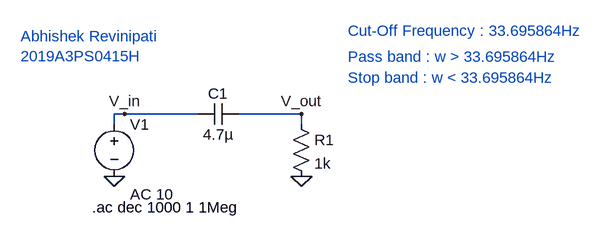
[diagram p0: schematic 2019A3PS0415H_high_pass.asc]
2019A3PS0415H_high_pass.asc, the LTspice schematic file:
Version 4
SHEET 1 880 680
WIRE 64 96 48 96
WIRE 176 96 64 96
WIRE 336 96 240 96
WIRE 48 112 48 96
WIRE 336 112 336 96
FLAG 48 192 0
FLAG 336 192 0
FLAG 336 96 V_out
FLAG 64 96 V_in
SYMBOL voltage 48 96 R0
WINDOW 123 24 124 Left 2
WINDOW 39 0 0 Left 0
SYMATTR InstName V1
SYMATTR Value ""
SYMATTR Value2 AC 10
SYMBOL cap 240 80 R90
WINDOW 0 0 32 VBottom 2
WINDOW 3 32 32 VTop 2
SYMATTR InstName C1
SYMATTR Value 4.7µ
SYMBOL res 320 96 R0
SYMATTR InstName R1
SYMATTR Value 1k
TEXT 14 240 Left 2 !.ac dec 1000 1 1Meg
TEXT 408 -32 Left 2 ;Cut-Off Frequency : 33.695864Hz
TEXT 408 8 Left 2 ;Pass band : w > 33.695864Hz
TEXT 408 40 Left 2 ;Stop band : w < 33.695864Hz
TEXT -96 -24 Left 2 ;Abhishek Revinipati\n2019A3PS0415H

The netlist it stands for:
* 2019A3PS0415H_high_pass.asc
V1 V_in 0 AC 10
C1 V_out V_in 4.7µ
R1 V_out 0 1k
.ac dec 1000 1 1Meg
* Cut-Off Frequency : 33.695864Hz
* Pass band : w > 33.695864Hz
* Stop band : w < 33.695864Hz
* Abhishek Revinipati
* 2019A3PS0415H
.backanno
.end